# EAGLE schematic cc_power_supply (EAGLE 6.5.0)
AUTHOR: Brad Campbell; REV: A; TITLE: Coilcube Power Supply
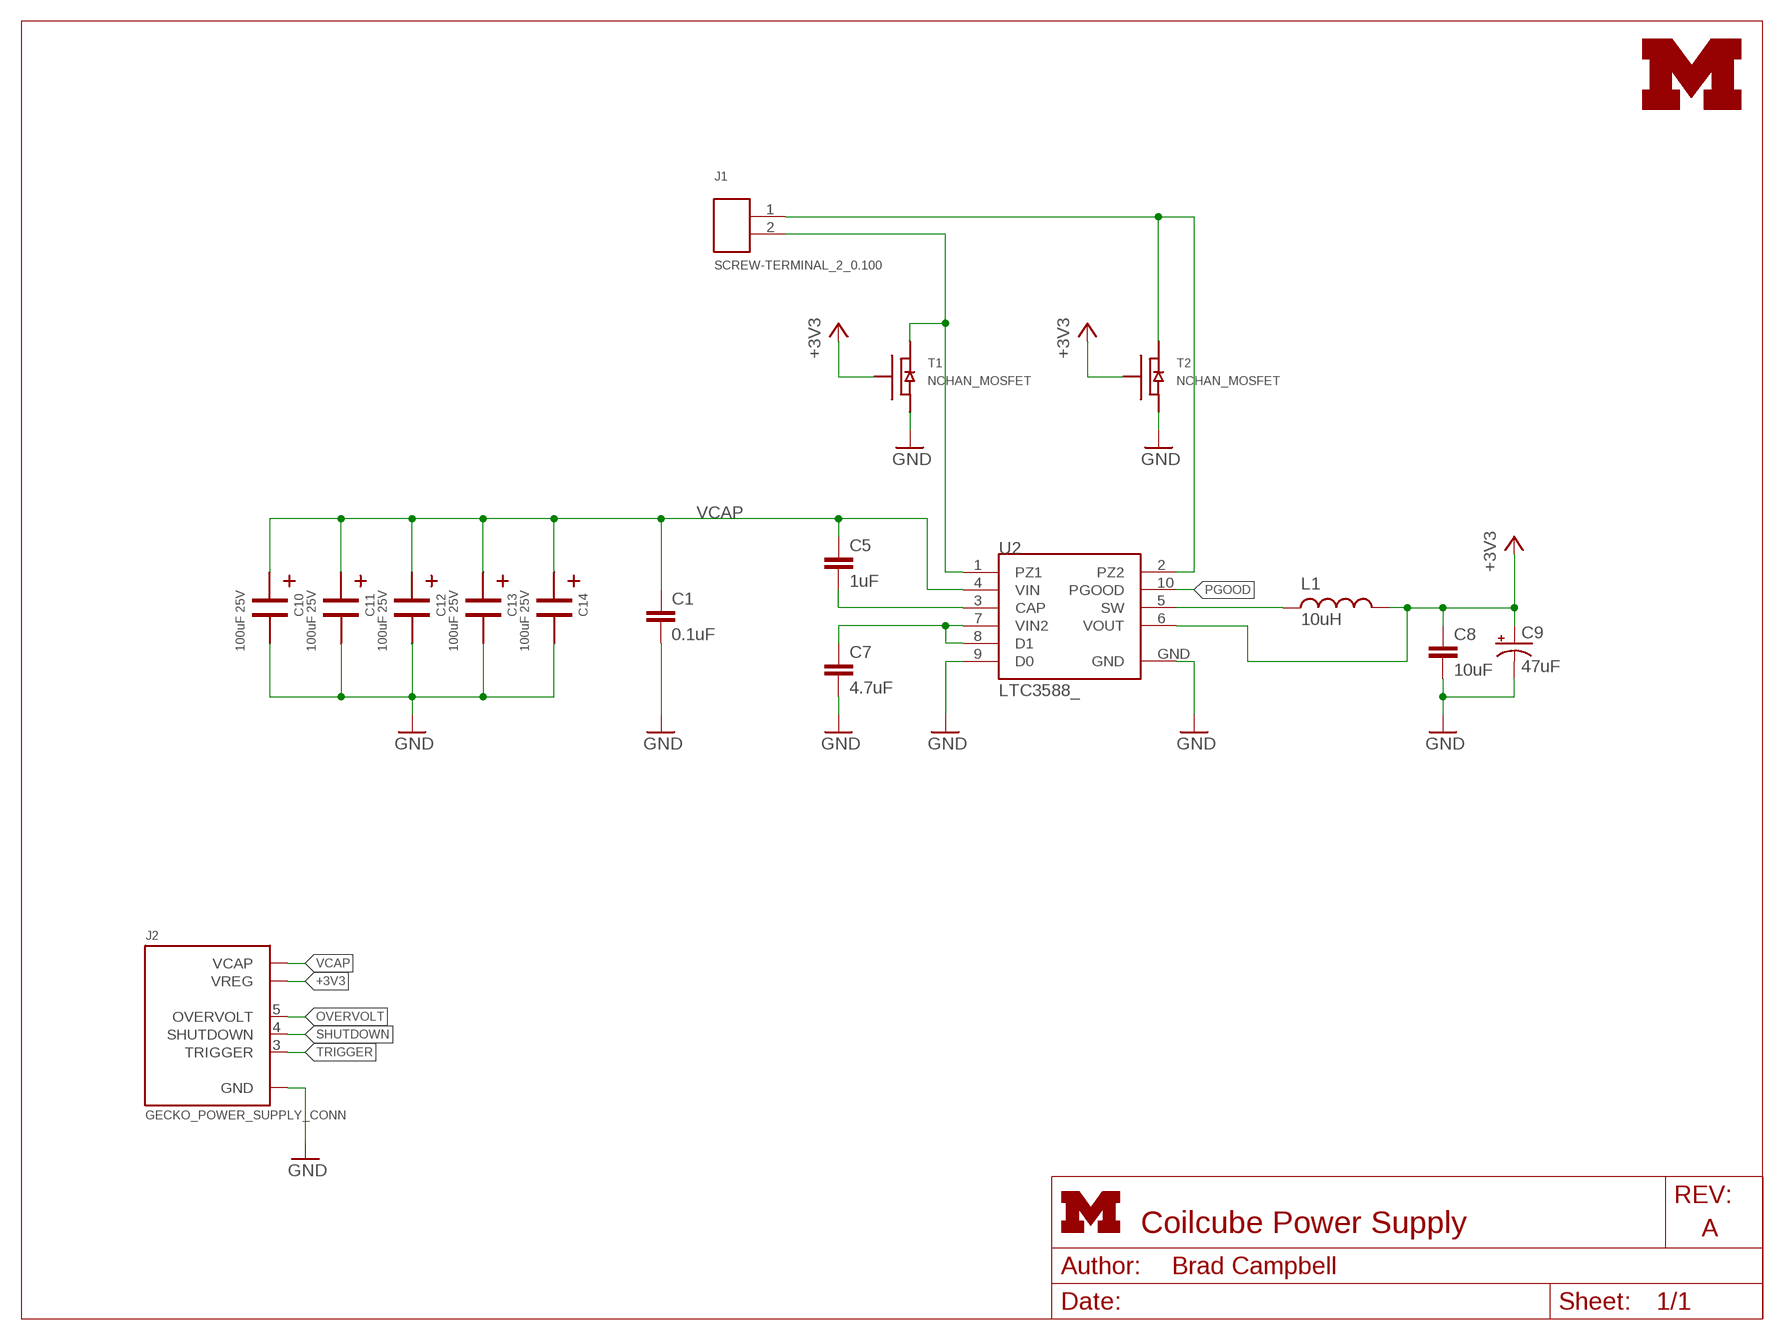
[diagram p0: schematic, sheet 1]
FRAME5 (LETTER_L): HEIGHT: 8.5in; WIDTH: 11in

## Parts
C1  0.1uF  C-EUC0603  [C0603]
C5  1uF  C-EUC0603  [C0603]
C7  4.7uF  C-EUC0603  [C0603]
C8  10uF  C-EUC1206  [C1206]
C9  47uF  CAP_POL1206  [EIA3216]
C10  100uF 25V  2917_CAP_POL  [2917_CAP_POL]
C11  100uF 25V  2917_CAP_POL  [2917_CAP_POL]
C12  100uF 25V  2917_CAP_POL  [2917_CAP_POL]
C13  100uF 25V  2917_CAP_POL  [2917_CAP_POL]
C14  100uF 25V  2917_CAP_POL  [2917_CAP_POL]
J1  SCREW-TERMINAL_2_0.100  [CONN_BLOCK_2]
J2  GECKO_POWER_SUPPLY_CONN  [HEADER1X6/0.05IN]
L1  10uH  INDUCTOR1210  [1210]
T1  NCHAN_MOSFET  [NCHAN_MOSFET]
T2  NCHAN_MOSFET  [NCHAN_MOSFET]
U2  LTC3588_  [MSOP-10-GNDPAD]
U$2  UMICH_SOLID_SMALL  [UMICH_SOLID_75MIL]

## Nets
+3V3: C8.1 C9.A(+) J2.2(VREG) L1.2 T1.G T2.G U2.6(VOUT)
GND: C1.2 C7.2 C8.2 C9.C(-) C10.- C11.- C12.- C13.- C14.- J2.1(GND) T1.S T2.S U2.9(D0) U2.GND
N$20: L1.1 U2.5(SW)
N$22: C5.2 U2.3(CAP)
OVERVOLT: J2.5(OVERVOLT)
PGOOD: U2.10(PGOOD)
PZ1: J1.2 T1.D U2.1(PZ1)
PZ2: J1.1 T2.D U2.2(PZ2)
SHUTDOWN: J2.4(SHUTDOWN)
TRIGGER: J2.3(TRIGGER)
VCAP: C1.1 C5.1 C10.+ C11.+ C12.+ C13.+ C14.+ J2.6(VCAP) U2.4(VIN)
VIN2: C7.1 U2.7(VIN2) U2.8(D1)

## Library data of the parts
C1 = rcl:C-EU: CAPACITOR, European symbol; DIGIKEY: 445-1316-1-ND
C5 = rcl:C-EU: CAPACITOR, European symbol; DIGIKEY: 445-1321-1-ND
C7 = rcl:C-EU: CAPACITOR, European symbol; DIGIKEY: 445-5178-1-ND
C8 = rcl:C-EU: CAPACITOR, European symbol; DIGIKEY: 399-8152-1-ND
C9 = SparkFun-Passives:CAP_POL: Capacitor Polarized These are standard SMD and PTH capacitors. Normally 10uF, 47uF, and 100uF in electrolytic and tantalum varieties. Always verify the external diameter of the through hole cap, it varies with capacity, voltage, and manufacturer. The EIA devices should be standard.; DIGIKEY: 399-3700-1-ND
C10-C14 = coilcube:2917_CAP_POL; DIGIKEY: 399-5175-1-ND
J1 = headers:SCREW-TERMINAL_2_0.100: 2x 0.100 in screw terminal block; DIGIKEY: 277-1273-ND
J2 = gecko:GECKO_POWER_SUPPLY_CONN: Header on the gecko power supply board.
L1 = SparkFun-Passives:INDUCTOR: Inductors Basic Inductor/Choke - 0603 and 1206. Footprints are not proven and vary greatly between part numbers.; DIGIKEY: 587-1625-1-ND
T1 T2 = Power_Metering:NCHAN_MOSFET; DIGIKEY: SI1302DL-T1-GE3CT-ND
U2 = SparkFun-PowerIC:LTC3588: Energy Harvesting Power Supply; DIGIKEY: LTC3588EMSE-1#PBF-ND
U$2 = logos:UMICH_SOLID